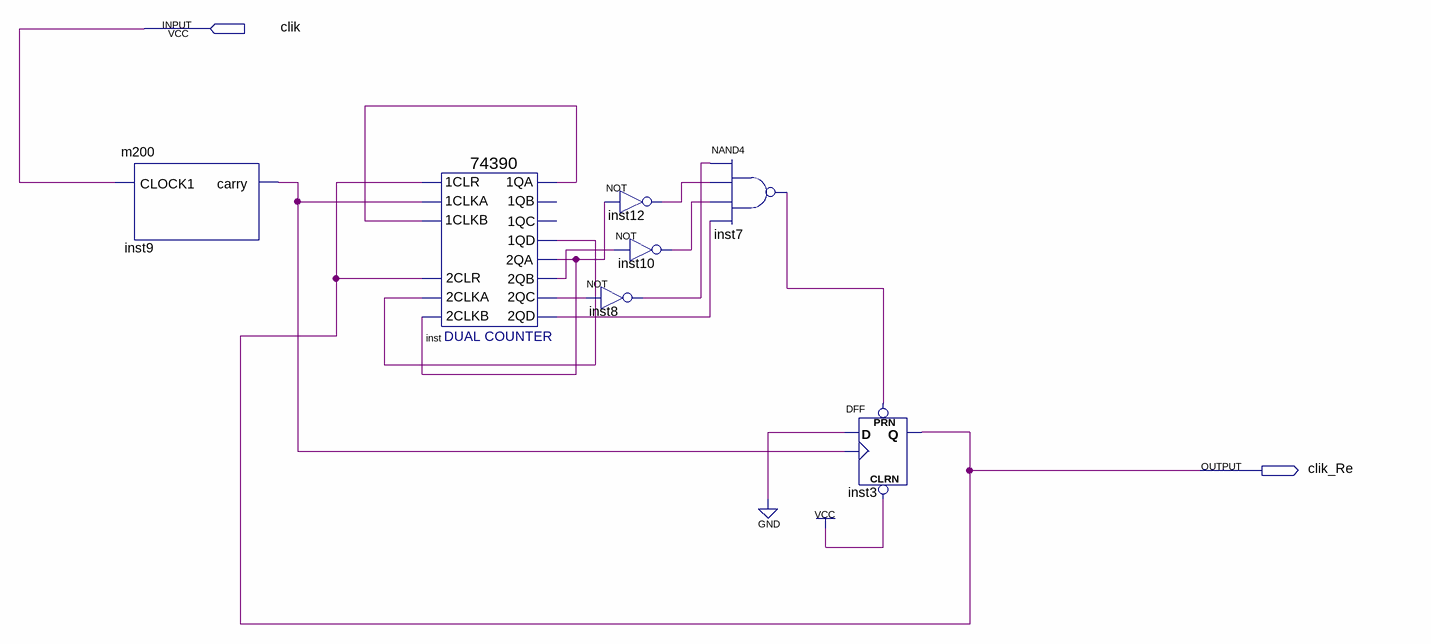
[diagram p0: schematic sheet]
// Quartus schematic Re.bdf as structural Verilog: 7 symbols, 2 pins
module Re (
  input  clik,
  output clik_Re
);

  wire inst7_out, inst8_out, inst9_carry, inst10_out, inst12_out, inst_1qa, inst_1qd, inst_2qa, inst_2qb,
       inst_2qc, inst_2qd;

  m200 inst9 (.CLOCK1(clik), .carry(inst9_carry));
  \74390  inst (
    .\2CLKA (inst_1qd), .\2CLR (clik_Re), .\2CLKB (inst_2qa), .\1CLR (clik_Re), .\1CLKA (inst9_carry),
    .\1CLKB (inst_1qa), .\1QA (inst_1qa), .\1QD (inst_1qd), .\2QA (inst_2qa), .\2QB (inst_2qb),
    .\2QC (inst_2qc), .\2QD (inst_2qd));  // open: 1QB, 1QC
  not inst12 (inst12_out, inst_2qa);
  not inst10 (inst10_out, inst_2qb);
  not inst8 (inst8_out, inst_2qc);
  nand inst7 (inst7_out, inst8_out, inst12_out, inst10_out, inst_2qd);
  DFF inst3 (.CLRN(1'b1), .CLK(inst9_carry), .D(1'b0), .PRN(inst7_out), .Q(clik_Re));
endmodule
